# EAGLE design WeatherStation-MM-Carrier (EAGLE 9.4.2)
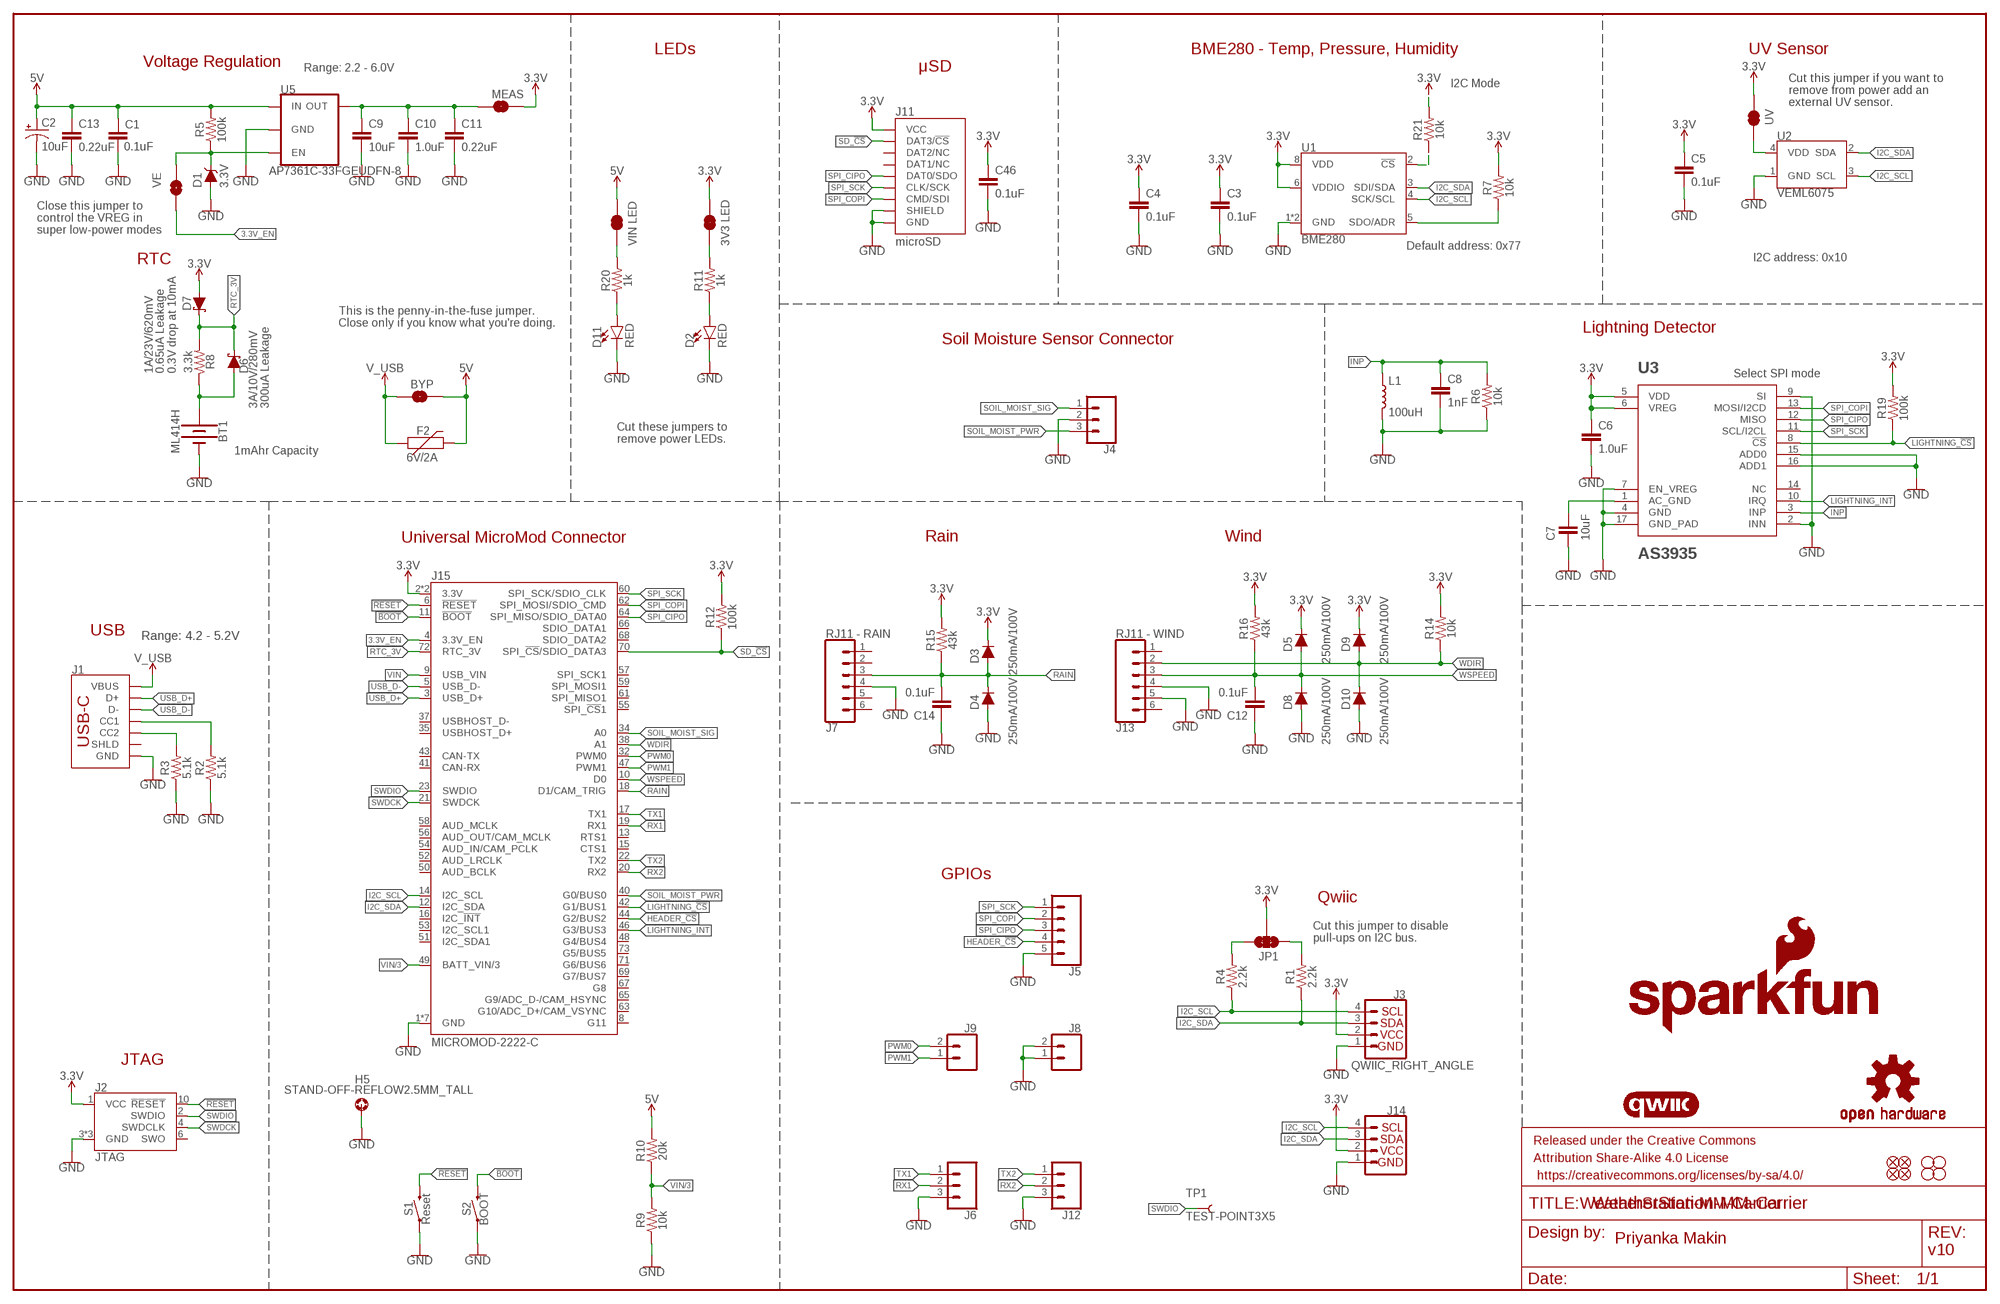
[diagram p0: schematic, sheet 1]

## Parts
BT1  ML414H  ML414H_IV01E_BATTERY  [ML414H_IV01E]
BYP  JUMPER-SMT_2_NO_SILK  [SMT-JUMPER_2_NO_SILK]
C1  0.1uF  0.1UF-0603-25V-(+80/-20%)  [0603]
C2  10uF  10UF-POLAR-EIA3216-16V-10%(TANT)  [EIA3216]
C3  0.1uF  0.1UF-0603-100V-10%  [0603]
C4  0.1uF  0.1UF-0603-100V-10%  [0603]
C5  0.1uF  0.1UF-0603-25V-(+80/-20%)  [0603]
C6  1.0uF  1.0UF-0603-16V-10%  [0603]
C7  10uF  10UF-0603-6.3V-20%  [0603]
C8  1nF  1.0NF/1000PF-0603-50V-10%  [0603]
C9  10uF  10UF-0603-6.3V-20%  [0603]
C10  1.0uF  1.0UF-0603-16V-10%  [0603]
C11  0.22uF  0.22UF-0603-25V-10%  [0603]
C12  0.1uF  0.1UF-0603-25V-(+80/-20%)  [0603]
C13  0.22uF  0.22UF-0603-25V-10%  [0603]
C14  0.1uF  0.1UF-0603-25V-(+80/-20%)  [0603]
C46  0.1uF  0.1UF-0603-25V-(+80/-20%)  [0603]
D1  3.3V  DIODE-ZENER-MM3Z3V3T1G  [SOD-323]
D2  RED  LED-RED0603  [LED-0603]
D3  250mA/100V  DIODE-BAS16J  [SOD-323]
D4  250mA/100V  DIODE-BAS16J  [SOD-323]
D5  250mA/100V  DIODE-BAS16J  [SOD-323]
D6  3A/10V/280mV  DIODE-SCHOTTKY-BAT60A  [SOD-323]
D7  1A/23V/620mV  DIODE-SCHOTTKY-BAT20J  [SOD-323]
D8  250mA/100V  DIODE-BAS16J  [SOD-323]
D9  250mA/100V  DIODE-BAS16J  [SOD-323]
D10  250mA/100V  DIODE-BAS16J  [SOD-323]
D11  RED  LED-RED0603  [LED-0603]
F2  6V/2A  PPTC_6V2A  [1210]
FD1  FIDUCIALUFIDUCIAL  [FIDUCIAL-MICRO]
FD2  FIDUCIALUFIDUCIAL  [FIDUCIAL-MICRO]
FD3  FIDUCIALUFIDUCIAL  [FIDUCIAL-MICRO]
FD4  FIDUCIALUFIDUCIAL  [FIDUCIAL-MICRO]
FRAME1  FRAME-LEDGER  [CREATIVE_COMMONS]
H1  STAND-OFF  [STAND-OFF]
H2  STAND-OFF  [STAND-OFF]
H3  STAND-OFF  [STAND-OFF]
H4  STAND-OFF  [STAND-OFF]
H5  STAND-OFF-REFLOW2.5MM_TALL  [STAND-OFF-REFLOW-M2.5]
J1  USB_C_2-LAYER_PADS  [USB-C-16P-2LAYER-PADS]
J2  JTAG  CORTEX_JTAG_DEBUG_MINIMUM_PTH  [2X5-PTH-1.27MM]
J3  QWIIC_RIGHT_ANGLE  QWIIC_CONNECTORJS-1MM  [JST04_1MM_RA]
J4  CONN_03LATCH  [LATCHTERMINAL-5MM-3]
J5  CONN_05NO_SILK  [1X05_NO_SILK]
J6  CONN_031X03_NO_SILK  [1X03_NO_SILK]
J7  RJ11 - RAIN  RJ11-6  [RJ11-6]
J8  CONN_021X02_NO_SILK  [1X02_NO_SILK]
J9  CONN_021X02_NO_SILK  [1X02_NO_SILK]
J11  microSD  MICRO-SD-SDIOPUSH-PUSH  [MICRO-SD-SOCKET]
J12  CONN_031X03_NO_SILK  [1X03_NO_SILK]
J13  RJ11 - WIND  RJ11-6  [RJ11-6]
J14  I2C_STANDARD_NO_SILK  [1X04_NO_SILK]
J15  MICROMOD-2222-C  [M.2-CONNECTOR-E]
JP1  JUMPER-SMT_3_2-NC_TRACE_SILK  [SMT-JUMPER_3_2-NC_TRACE_SILK]
JP2  VIN LED  JUMPER-SMT_2_NC_TRACE_SILK  [SMT-JUMPER_2_NC_TRACE_SILK]
JP3  UV  JUMPER-SMT_2_NC_TRACE_SILK  [SMT-JUMPER_2_NC_TRACE_SILK]
JP4  3V3 LED  JUMPER-SMT_2_NC_TRACE_SILK  [SMT-JUMPER_2_NC_TRACE_SILK]
JP6  VE  JUMPER-SMT_2_NO_SILK  [SMT-JUMPER_2_NO_SILK]
L1  100uH  MA5532-AE  [MA5532-AE]
LOGO1  SFE_LOGO_NAME_FLAME.2_INCH  [SFE_LOGO_NAME_FLAME_.2]
LOGO2  QWIIC_LOGO_CONNECTOR  [QWIIC_5.5MM]
LOGO3  OSHW-LOGOM  [OSHW-LOGO-M]
MEAS  JUMPER-COMBO_2_NC_TRACE  [COMBO-JUMPER_2_NC_TRACE]
R1  2.2k  2.2KOHM-0603-1/10W-1%  [0603]
R2  5.1k  5.1KOHM5.1KOHM-0603-1/10W-1%  [0603]
R3  5.1k  5.1KOHM5.1KOHM-0603-1/10W-1%  [0603]
R4  2.2k  2.2KOHM-0603-1/10W-1%  [0603]
R5  100k  100KOHM-0603-1/10W-1%  [0603]
R6  10k  10KOHM-0603-1/10W-1%  [0603]
R7  10k  10KOHM-0603-1/10W-1%  [0603]
R8  3.3k  3.3KOHM-0603-1/10W-1%  [0603]
R9  10k  10KOHM-0603-1/10W-1%  [0603]
R10  20k  20KOHM-0603-1/10W-1%  [0603]
R11  1k  1KOHM-0603-1/10W-1%  [0603]
R12  100k  100KOHM-0603-1/10W-1%  [0603]
R14  10k  10KOHM-0603-1/10W-1%  [0603]
R15  43k  43KOHM-0603-1/10W-1%  [0603]
R16  43k  43KOHM-0603-1/10W-1%  [0603]
R19  100k  100KOHM-0603-1/10W-1%  [0603]
R20  1k  1KOHM-0603-1/10W-1%  [0603]
R21  10k  10KOHM-0603-1/10W-1%  [0603]
S1  Reset  MOMENTARY-SWITCH-SPST-SMD-5.2-TALL-REDUNDANT  [TACTILE_SWITCH_SMD_5.2MM]
S2  BOOT  MOMENTARY-SWITCH-SPST-SMD-5.2-TALL-REDUNDANT  [TACTILE_SWITCH_SMD_5.2MM]
TP1  TEST-POINT3X5  [PAD.03X.05]
U1  BME280  [LGA-8-2.5X2.5]
U2  VEML6075  [VEML6075_A3OP]
U3  AS3935  AS3935QFN  [16LD_MLPQ]
U5  AP7361C-33FGEUDFN-8  [UDFN-8]

## Nets
3.3V: C3.1 C4.1 C5.1 C6.1 C46.1 D3.C D5.C D7.A D9.C J2.1(VCC) J3.2 J11.VCC J14.2 J15.2(3.3V) J15.74(3.3V) JP1.2 JP3.2 JP4.2 MEAS.2 MEAS.4 R7.2 R12.2 R14.2 R15.2 R16.2 R19.2 R21.2 U1.6(VDDIO) U1.8(VDD) U3.5(VDD) U3.6(VREG)
3.3V_EN: J15.4(3.3V_EN) JP6.1
!BOOT!: J15.11(!BOOT!) S2.3 S2.4
!RESET!: J2.10(!RESET) J15.6(!RESET!) S1.3 S1.4
GND: BT1.- C1.2 C2.- C3.2 C4.2 C5.2 C6.2 C7.2 C8.2 C9.2 C10.2 C11.2 C12.1 C13.2 C14.1 C46.2 D1.A D2.C D4.A D8.A D10.A D11.C H5.1 J1.GND J1.GND2(GND) J2.3(GND) J2.5(GND) J2.9(GND) J3.1 J4.2 J5.5 J6.3 J7.4 J8.1 J8.2 J11.CD1(SHIELD) J11.GND J11.GND1(GND) J11.GND3(GND) J12.3 J13.4 J13.5 J14.1 J15.1(GND) J15.7(GND) J15.33(GND) J15.36(GND) J15.39(GND) J15.45(GND) J15.75(GND) L1.2 R2.1 R3.1 R6.1 R9.1 S1.1 S1.2 S2.1 S2.2 U1.1(GND) U1.7(GND) U2.1(GND) U3.2(INN) U3.4(GND) U3.7(EN_VREG) U3.9(SI) U3.15(ADD0) U3.16(ADD1) U3.17(GND_PAD) U5.4(GND) U5.EP(GND)
HEADER_!CS!: J5.4 J15.44(G2/BUS2)
I2C_SCL: J3.4 J14.4 J15.14(I2C_SCL) R4.1 U1.4(SCK/SCL) U2.3(SCL)
I2C_SDA: J3.3 J14.3 J15.12(I2C_SDA) R1.1 U1.3(SDI/SDA) U2.2(SDA)
INP: C8.1 L1.1 R6.2 U3.3(INP)
LIGHTNING_!CS!: J15.42(G1/BUS1) R19.1 U3.8(!CS)
LIGHTNING_INT: J15.46(G3/BUS3) U3.10(IRQ)
N$1: C9.1 C10.1 C11.1 MEAS.1 MEAS.3 U5.1(OUT)
N$2: JP1.3 R4.2
N$3: JP1.1 R1.2
N$4: JP4.1 R11.2
N$5: JP2.1 R20.2
N$6: D2.A R11.1
N$7: JP3.1 U2.4(VDD)
N$8: R7.1 U1.5(SDO/ADR)
N$10: J1.A5(CC1) R2.2
N$11: J1.B5(CC2) R3.2
N$14: BT1.+ D6.A R8.1
N$15: C7.1 U3.1(AC_GND)
N$16: D11.A R20.1
N$19: R21.1 U1.2(!CS)
PWM0: J9.2 J15.32(PWM0)
PWM1: J9.1 J15.47(PWM1)
RAIN: C14.2 D3.A D4.C J7.3 J15.18(D1/CAM_TRIG) R15.1
RTC_3V: D6.C D7.C J15.72(RTC_3V) R8.2
RX1: J6.2 J15.19(RX1)
RX2: J12.2 J15.20(RX2)
SD_!CS!: J11.CS/DAT3(DAT3/!CS!) J15.70(SPI_!CS!/SDIO_DATA3) R12.1
SOIL_MOIST_PWR: J4.3 J15.40(G0/BUS0)
SOIL_MOIST_SIG: J4.1 J15.34(A0)
SPI_CIPO: J5.3 J11.DO/DAT0(DAT0/SDO) J15.64(SPI_MISO/SDIO_DATA0) U3.12(MISO)
SPI_COPI: J5.2 J11.DI/CMD(CMD/SDI) J15.62(SPI_MOSI/SDIO_CMD) U3.13(MOSI/I2CD)
SPI_SCK: J5.1 J11.SCLK(CLK/SCK) J15.60(SPI_SCK/SDIO_CLK) U3.11(SCL/I2CL)
SWDCK: J2.4(SWDCLK) J15.21(SWDCK)
SWDIO: J2.2(SWDIO) J15.23(SWDIO) TP1.P$1
TX1: J6.1 J15.17(TX1)
TX2: J12.1 J15.22(TX2)
USB_D+: J1.A6(D+) J1.B6(D+) J15.3(USB_D+)
USB_D-: J1.A7(D-) J1.B7(D-) J15.5(USB_D-)
V_USB: BYP.1 F2.1 J1.VBUS1(VBUS) J1.VBUS2(VBUS)
VIN: BYP.2 C1.1 C2.+ C13.1 F2.2 J15.9(USB_VIN) JP2.2 R5.2 R10.2 U5.8(IN) ; supply symbol labelled 5V
VIN/3: J15.49(BATT_VIN/3) R9.2 R10.1
VREG_EN: D1.C JP6.2 R5.1 U5.5(EN)
WDIR: D9.A D10.C J13.2 J15.38(A1) R14.1
WSPEED: C12.2 D5.A D8.C J13.3 J15.10(D0) R16.1
Unconnected: J1.SHLD1(SHLD) J1.SHLD2(SHLD) J1.SHLD3(SHLD) J1.SHLD4(SHLD) J2.6(SWO) J7.1 J7.2 J7.5 J7.6 J11.DAT1(DAT1/NC) J11.DAT2(DAT2/NC) J13.1 J13.6 J15.8(G11) J15.13(RTS1) J15.15(CTS1) J15.16(I2C_!INT!) J15.35(USBHOST_D+) J15.37(USBHOST_D-) J15.41(CAN-RX) J15.43(CAN-TX) J15.48(G4/BUS4) J15.50(AUD_BCLK) J15.51(I2C_SDA1) J15.52(AUD_LRCLK) J15.53(I2C_SCL1) J15.54(AUD_IN/CAM_PCLK) J15.55(SPI_!CS!1) J15.56(AUD_OUT/CAM_MCLK) J15.57(SPI_SCK1) J15.58(AUD_MCLK) J15.59(SPI_MOSI1) J15.61(SPI_MISO1) J15.63(G10/ADC_D+/CAM_VSYNC) J15.65(G9/ADC_D-/CAM_HSYNC) J15.66(SDIO_DATA1) J15.67(G8) J15.68(SDIO_DATA2) J15.69(G7/BUS7) J15.71(G6/BUS6) J15.73(G5/BUS5) U3.14(NC)

## Notes on the sheet
- LEDs | BME280 - Temp, Pressure, Humidity | UV Sensor
- Voltage Regulation
- Range: 2.2 - 6.0V | μSD
- I2C Mode
- Cut this jumper if you want to
  remove from power add an 
  external UV sensor.
- Close this jumper to 
  control the VREG in 
  super low-power modes
- Default address: 0x77
- RTC | I2C address: 0x10
- This is the penny-in-the-fuse jumper.
  Close only if you know what you're doing.
- Lightning Detector
- Soil Moisture Sensor Connector
- 0.65uA Leakage
  0.3V drop at 10mA
- Select SPI mode
- 300uA Leakage
- Cut these jumpers to
  remove power LEDs.
- 1mAhr Capacity
- Universal MicroMod Connector | Rain | Wind
- USB
- Range: 4.2 - 5.2V
- GPIOs
- Qwiic
- Cut this jumper to disable
  pull-ups on I2C bus.
- JTAG
- WeatherStation-MM-Carrier
- Priyanka Makin
- v10

## Library data of the parts
BT1 = SparkFun-Batteries:ML414H_IV01E_BATTERY: SEIKO ML414H-IV01E Reflowable Lithium Battery ML414H is a rechargeable, coin type battery with features such as Pb-free reflowable (Peak temperature: 260 C) and high temperature heat resistance. Battery Characteristics: 3.1V max voltage Voff is 2V 1mAH 3k series resistor with battery 72 hour charge time from 2.0-3.1V 2.3-2.8V initial charge; PROD_ID: BATT-14267
BYP JP6 = SparkFun-Jumpers:JUMPER-SMT_2_NO: Normally open jumper This jumper has two pads in close proximity to each other. Apply solder to close the connection. Round pads are easier to solder for beginners, but are a lot larger. SparkFun Product that uses the round pads: SparkFun EL Sequencer <https://www.sparkfun.com/products/12781>
C1 C5 C12 C14 C46 = SparkFun-Capacitors:0.1UF: 0.1µF ceramic capacitors A capacitor is a passive two-terminal electrical component used to store electrical energy temporarily in an electric field.; PROD_ID: CAP-00810
C2 = SparkFun-Capacitors:10UF-POLAR: 10.0µF polarized capacitors A capacitor is a passive two-terminal electrical component used to store electrical energy temporarily in an electric field.; PROD_ID: CAP-00811
C3 C4 = SparkFun-Capacitors:0.1UF: 0.1µF ceramic capacitors A capacitor is a passive two-terminal electrical component used to store electrical energy temporarily in an electric field.; PROD_ID: CAP-08390
C6 C10 = SparkFun-Capacitors:1.0UF: 1µF ceramic capacitors A capacitor is a passive two-terminal electrical component used to store electrical energy temporarily in an electric field.; PROD_ID: CAP-00868
C7 C9 = SparkFun-Capacitors:10UF: 10.0µF ceramic capacitors A capacitor is a passive two-terminal electrical component used to store electrical energy temporarily in an electric field.; PROD_ID: CAP-11015
C8 = SparkFun-Capacitors:1.0NF/1000PF: 1nF/1,000pF ceramic capacitors A capacitor is a passive two-terminal electrical component used to store electrical energy temporarily in an electric field.; PROD_ID: CAP-07886
C11 C13 = SparkFun-Capacitors:0.22UF: 0.22µF ceramic capacitors A capacitor is a passive two-terminal electrical component used to store electrical energy temporarily in an electric field.; PROD_ID: CAP-07822
D1 = SparkFun-DiscreteSemi:DIODE-ZENER: Zener Diode A Zener diode allows current to flow from its anode to its cathode like a normal semiconductor diode, but it also permits current to flow in the reverse direction when its "Zener voltage" is reached. - WIkipedia; PROD_ID: DIO-11284
D2 D11 = SparkFun-LED:LED-RED: Red SMD LED Used in manufacturing of most products at SparkFun Packages: 0603 - SMD 0603 package [Product Link] <http://docs.avagotech.com/docs/AV02-0551EN> 0603 SMART - SMD 0603 SMART package ( more efficient and expensive)[Product Link] <http://www.osram-os.com/Graphics/XPic2/00077099_0.pdf> 1206 - SMD1206 package [Product Link] <https://www.sparkfun.com/datasheets/DevTools/LilyPad/Q150OVS4.pdff> SparkFun Products: Pro Mini 328 -5V <https://www.sparkfun.com/products/821> RedBoard <https://www.sparkfun.com/products/12757> IOIO-OTG <https://www.sparkfun.com/products/13613>; PROD_ID: DIO-00819
D3-D5 D8-D10 = SparkFun-DiscreteSemi:DIODE: Diode These are standard reverse protection diodes and small signal diodes. SparkFun Products: SparkFun SparkPunk Sound Kit <https://www.sparkfun.com/products/11177> SparkFun ESP8266 Thing <https://www.sparkfun.com/products/13231>; PROD_ID: DIO-09646
D6 = SparkFun-DiscreteSemi:DIODE-SCHOTTKY: Schottky diode A Schottky diode is a semiconductor diode which has a low forward voltage drop and a very fast switching action.; PROD_ID: DIO-14072
D7 = SparkFun-DiscreteSemi:DIODE-SCHOTTKY: Schottky diode A Schottky diode is a semiconductor diode which has a low forward voltage drop and a very fast switching action.; PROD_ID: DIO-11623
F2 = SparkFun-Fuses:PPTC: Resettable Fuse PPTC Resettable Fuse. Really a sort of resistor with a polymeric positive temperature coefficient whose resistance increases dramatically with an increase in temperature. When heated by the power passing through the resistance rises causing the current to be limited, protecting the circuit. This is achieved by the transition of the polymer from a crystalline to an amorphous state where the conductive carbon separates breaking the conductive pathways found in the cool crystalline structure. When a PPTC cools back down it resumes conducting letting the circuit turn back on. SparkFun Products: SparkFun RedBoard - Programmed with Arduino <https://www.sparkfun.com/products/12757> Pro Micro - 5V/16MHz <https://www.sparkfun.com/products/12640> Arduino Pro 328 - 5V/16MHz <https://www.sparkfun.com/products/10915> MP3 Trigger <https://www.sparkfun.com/products/13720>; PROD_ID: RES-14313
FD1-FD4 = SparkFun-Aesthetics:FIDUCIAL: Fiducial Alignment Points Point-of-reference for pick-and-place machines and other optical instruments.
FRAME1 = SparkFun-Aesthetics:FRAME-LEDGER: Schematic Frame - Ledger Standard 11x14 US Ledger frame
H1-H4 = SparkFun-Hardware:STAND-OFF: Stand Off Drill holes for mechanically mounting via screws, standoffs, etc. Note: Use the keepout ring to avoid running the screw head into surrounding components. Variant Overviews STAND-OFF - Mechanical footprint for a #4 phillips button head screw. STAND-OFF-TIGHT - Mechanical footprint for a #4 phillips button head screw, Example SparkFun Products Screw - Phillips Head (1/4", 4-40, 10 pack) <https://www.sparkfun.com/products/10453> (PRT-10453) Screw - Phillips Head (1/2", 4-40, 10 pack) <https://www.sparkfun.com/products/10452> (PRT-10452) Screw - Phillips Head (3/4", 4-40, 10 pack) <https://www.sparkfun.com/products/10451> (PRT-10451) Screw - Phillips Head (1", 4-40, 10 pack) <https://www.sparkfun.com/products/10450> (PRT-10450)
H5 = SparkFun-Hardware:STAND-OFF-REFLOW: Stand Off Reflow Compatible A metal standoff that can be placed and reflowed onto a PCB.; PROD_ID: HW-14899
J1 = SparkFun-Connectors:USB_C: USB Type C 16Pin Connector Super Speed pins not available on the 16-pin purely SMD connector so this part is best for USB 2.0 implementations. D1 and D2 are tied together enabling D+/- no matter which way the cable is plugged into the connector. The two channel configuration pins (CC1/2) are exposed. These are normally connected to ground via 5.1k resistors but can be reconfigured for high current/high power applications.; PROD_ID: CONN-14122
J2 = SparkFun-Connectors:CORTEX_JTAG_DEBUG_MINIMUM: Cortex Debug Connector - 10 pin Supports JTAG debug, Serial Wire debug, and Serial Wire Viewer. PTH and SMD connector options available. General Connector Information <http://infocenter.arm.com/help/topic/com.arm.doc.faqs/attached/13634/cortex_debug_connectors.pdf> Products: PTH Connector <http://www.digikey.com/product-detail/en/cnc-tech/3220-10-0100-00/1175-1627-ND/3883661> -via Digi-Key SparkFun PSoc <https://www.sparkfun.com/products/13229> SparkFun T <https://www.sparkfun.com/products/13810>
J3 = SparkFun-Connectors:QWIIC_CONNECTOR: SparkFun I2C Standard Qwiic Connector An SMD 1mm pitch JST connector makes it easy and quick (get it? Qwiic?) to connect I2C devices to each other. The Qwiic system <http://www.sparkfun.com/qwiic> enables fast and solderless connection between popular platforms and various sensors and actuators. We carry 200mm <https://www.sparkfun.com/products/14204>, 100mm <https://www.sparkfun.com/products/14205>, 50mm <https://www.sparkfun.com/products/14206>, and breadboard friendly <https://www.sparkfun.com/products/14207> Qwiic cables. We also offer 10 pcs strips <https://www.sparkfun.com/products/14323> the SMD connectors.; PROD_ID: CONN-13694
J4 = SparkFun-Connectors:CONN_03: Multi connection point. Often used as Generic Header-pin footprint for 0.1 inch spaced/style header connections On any of the 0.1 inch spaced packages, you can populate with these: Break Away Headers - Straight <https://www.sparkfun.com/products/116> (PRT-00116) Break Away Male Headers - Right Angle <https://www.sparkfun.com/products/553> (PRT-00553) Female Headers <https://www.sparkfun.com/products/115> (PRT-00115) Break Away Headers - Machine Pin <https://www.sparkfun.com/products/117> (PRT-00117) Break Away Female Headers - Swiss Machine Pin <https://www.sparkfun.com/products/743> (PRT-00743) Stackable Header - 3 Pin (Female, 0.1") <https://www.sparkfun.com/products/13875> (PRT-13875) For SCREWTERMINALS and SPRING TERMINALS visit here: Screw Terimnals on SparkFun.com <https://www.sparkfun.com/search/results?term=Screw+Terminals> (5mm/3.5mm/2.54mm spacing) This device is also useful as a general connection point to wire up your design to another part of your project. Our various solder wires solder well into these plated through hole pads. Hook-Up Wire - Assortment (Stranded, 22 AWG) <https://www.sparkfun.com/products/11375> (PRT-11375) Hook-Up Wire - Assortment (Solid Core, 22 AWG) <https://www.sparkfun.com/products/11367> (PRT-11367) View the entire wire category on our website here <https://www.sparkfun.com/categories/141> Special notes: Molex polarized connector foot print use with SKU : PRT-08232 with associated crimp pins and housings.; PROD_ID: CONN-14721
J5 = SparkFun-Connectors:CONN_05: Multi connection point. Often used as Generic Header-pin footprint for 0.1 inch spaced/style header connections On any of the 0.1 inch spaced packages, you can populate with these: Break Away Headers - Straight <https://www.sparkfun.com/products/116> (PRT-00116) Break Away Male Headers - Right Angle <https://www.sparkfun.com/products/553> (PRT-00553) Female Headers <https://www.sparkfun.com/products/115> (PRT-00115) Break Away Headers - Machine Pin <https://www.sparkfun.com/products/117> (PRT-00117) Break Away Female Headers - Swiss Machine Pin <https://www.sparkfun.com/products/743> (PRT-00743) For SCREWTERMINALS and SPRING TERMINALS visit here: Screw Terimnals on SparkFun.com <https://www.sparkfun.com/search/results?term=Screw+Terminals> (5mm/3.5mm/2.54mm spacing) This device is also useful as a general connection point to wire up your design to another part of your project. Our various solder wires solder well into these plated through hole pads. Hook-Up Wire - Assortment (Stranded, 22 AWG) <https://www.sparkfun.com/products/11375> (PRT-11375) Hook-Up Wire - Assortment (Solid Core, 22 AWG) <https://www.sparkfun.com/products/11367> (PRT-11367) View the entire wire category on our website here <https://www.sparkfun.com/categories/141> Special notes: Molex polarized connector foot print use with SKU : PRT-08231 with associated crimp pins and housings. 1MM SMD Version SKU: PRT-10208
J6 J12 = SparkFun-Connectors:CONN_03: Multi connection point. Often used as Generic Header-pin footprint for 0.1 inch spaced/style header connections On any of the 0.1 inch spaced packages, you can populate with these: Break Away Headers - Straight <https://www.sparkfun.com/products/116> (PRT-00116) Break Away Male Headers - Right Angle <https://www.sparkfun.com/products/553> (PRT-00553) Female Headers <https://www.sparkfun.com/products/115> (PRT-00115) Break Away Headers - Machine Pin <https://www.sparkfun.com/products/117> (PRT-00117) Break Away Female Headers - Swiss Machine Pin <https://www.sparkfun.com/products/743> (PRT-00743) Stackable Header - 3 Pin (Female, 0.1") <https://www.sparkfun.com/products/13875> (PRT-13875) For SCREWTERMINALS and SPRING TERMINALS visit here: Screw Terimnals on SparkFun.com <https://www.sparkfun.com/search/results?term=Screw+Terminals> (5mm/3.5mm/2.54mm spacing) This device is also useful as a general connection point to wire up your design to another part of your project. Our various solder wires solder well into these plated through hole pads. Hook-Up Wire - Assortment (Stranded, 22 AWG) <https://www.sparkfun.com/products/11375> (PRT-11375) Hook-Up Wire - Assortment (Solid Core, 22 AWG) <https://www.sparkfun.com/products/11367> (PRT-11367) View the entire wire category on our website here <https://www.sparkfun.com/categories/141> Special notes: Molex polarized connector foot print use with SKU : PRT-08232 with associated crimp pins and housings.
J7 J13 = SparkFun-Connectors:RJ11-6: RJ11 Jack - 6 pin Commonly found on CAT3 devices and some Microchip programmers. Here is the connector we sell at SparkFun: RJ11 6-Pin Connector <https://www.sparkfun.com/products/132> (PRT-00132) Datasheet <http://www.sparkfun.com/datasheets/Prototyping/Connectors/RJ11-Datasheet.pdf> It is used on this SparkFun product: SparkFun Weather Shield <https://www.sparkfun.com/products/12081> (DEV-12081) Weather Meters <https://www.sparkfun.com/products/8942> (SEN-08942); PROD_ID: CONN-08590; SF_ID: PRT-00132; VALUE: RJ11
J8 J9 = SparkFun-Connectors:CONN_02: Multi connection point. Often used as Generic Header-pin footprint for 0.1 inch spaced/style header connections On any of the 0.1 inch spaced packages, you can populate with these: Break Away Headers - Straight <https://www.sparkfun.com/products/116> (PRT-00116) Break Away Male Headers - Right Angle <https://www.sparkfun.com/products/553> (PRT-00553) Female Headers <https://www.sparkfun.com/products/115> (PRT-00115) Break Away Headers - Machine Pin <https://www.sparkfun.com/products/117> (PRT-00117) Break Away Female Headers - Swiss Machine Pin <https://www.sparkfun.com/products/743> (PRT-00743) For SCREWTERMINALS and SPRING TERMINALS visit here: Screw Terimnals on SparkFun.com <https://www.sparkfun.com/search/results?term=Screw+Terminals> (5mm/3.5mm/2.54mm spacing) This device is also useful as a general connection point to wire up your design to another part of your project. Our various solder wires solder well into these plated through hole pads. Hook-Up Wire - Assortment (Stranded, 22 AWG) <https://www.sparkfun.com/products/11375> (PRT-11375) Hook-Up Wire - Assortment (Solid Core, 22 AWG) <https://www.sparkfun.com/products/11367> (PRT-11367) View the entire wire category on our website here <https://www.sparkfun.com/categories/141> Special notes: Molex polarized connector foot print use with: PRT-08233 with associated crimp pins and housings. 2.54_SCREWTERM for use with PRT-10571. 3.5mm Screw Terminal footprints for PRT-08084 5mm Screw Terminal footprints for use with PRT-08432
J11 = SparkFun-Connectors:MICRO-SD-SDIO: microSD Socket for Transflash Push-push type µSD socket. tDoc lines correctly indicate media card edge positions when inserting (unlocked, locked, depressed). NOTE: CD1 and CD2 are connected internally, and the default detect state of the socket is detect pin to ground. SparkFun Products: WAV Trigger <https://www.sparkfun.com/products/13660> CAN-Bus Shield <https://www.sparkfun.com/products/13262> SparkFun Level Shifing microSD Breakout <https://www.sparkfun.com/products/13743>; PROD_ID: CONN-07820
J14 = SparkFun-Connectors:I2C_STANDARD: SparkFun I2C Standard Pinout Header SparkFun has standardized on a pinout for all I2C based sensor breakouts. This pinout allows I2C boards to be plugged directly into the headers on Arduino Uno compatible boards, and to be daisy chained easily. Example SparkFun Products: SparkFun Atmospheric Sensor Breakout - BME280 <https://www.sparkfun.com/products/13676> SparkFun Altitude/Pressure Sensor Breakout - MPL3115A2 <https://www.sparkfun.com/products/11084> SparkFun TOF Range Finder Sensor - VL6180 <https://www.sparkfun.com/products/12785>
J15 = SparkFun-MicroMod:MICROMOD: MicroMod Connector Description: A card edge connector and mating PCB connector to allow various MicroMod Processor Boards to be coupled with various carrier boards of different capabilities. Based on the M.2 standard.; PROD_ID: CONN-14877
JP1 = SparkFun-Jumpers:JUMPER-SMT_3_2-NC_TRACE: Normally closed trace jumper (2 of 2 connections) This jumper has a trace between all three pads so they are normally closed (NC). Use a razor knife to open the connection(s). For best results follow the IPC guidelines for cutting traces: Cutout at least 0.063 mm (0.005 in). Remove all loose material to clean up the cut area. Seal the cut with an approved epoxy. Reapply solder to reclose the connection(s).
JP2-JP4 = SparkFun-Jumpers:JUMPER-SMT_2_NC_TRACE: Normally closed trace jumper This jumper has a trace between two pads so it's normally closed (NC). Use a razor knife to open the connection. For best results follow the IPC guidelines for cutting traces: Cutout at least 0.063 mm (0.005 in). Remove all loose material to clean up the cut area. Seal the cut with an approved epoxy. Reapply solder to reclose the connection.
L1 = SparkFun-Coils:MA5532-AE: RFID Transponder Coil - MA5532-AE; PROD_ID: NDUC-11334
LOGO1 = SparkFun-Aesthetics:SFE_LOGO_NAME_FLAME: SparkFun Font Logo w/ Flame This is the SparkFun full logo. The logo on the schematic will always be the same size; the package variant is the height of the flame part of the logo. Default layer for the logo on the board is tSilk.
LOGO2 = SparkFun-Aesthetics:QWIIC_LOGO: Qwiic Logos for placement on schematic and PCB. The 5.5mm silk logo is best for placing next to Qwiic connector.
LOGO3 = SparkFun-Aesthetics:OSHW-LOGO: Open-Source Hardware (OSHW) Logo This logo indicates the piece of hardware it is found on incorporates a OSHW license and/or adheres to the definition of open source hardware found here: http://freedomdefined.org/OSHW
MEAS = SparkFun-Jumpers:JUMPER-COMBO_2_NC_TRACE
R1 R4 = SparkFun-Resistors:2.2KOHM: 2.2kΩ resistor A resistor is a passive two-terminal electrical component that implements electrical resistance as a circuit element. Resistors act to reduce current flow, and, at the same time, act to lower voltage levels within circuits. - Wikipedia; PROD_ID: RES-08272
R2 R3 = SparkFun-Resistors:5.1KOHM; PROD_ID: RES-12083
R5 R12 R19 = SparkFun-Resistors:100KOHM: 100kΩ resistor A resistor is a passive two-terminal electrical component that implements electrical resistance as a circuit element. Resistors act to reduce current flow, and, at the same time, act to lower voltage levels within circuits. - Wikipedia; PROD_ID: RES-07828
R6 R7 R9 R14 R21 = SparkFun-Resistors:10KOHM: 10kΩ resistor A resistor is a passive two-terminal electrical component that implements electrical resistance as a circuit element. Resistors act to reduce current flow, and, at the same time, act to lower voltage levels within circuits. - Wikipedia; PROD_ID: RES-00824
R8 = SparkFun-Resistors:3.3KOHM: 3.3kΩ resistor A resistor is a passive two-terminal electrical component that implements electrical resistance as a circuit element. Resistors act to reduce current flow, and, at the same time, act to lower voltage levels within circuits. - Wikipedia; PROD_ID: RES-07851
R10 = SparkFun-Resistors:20KOHM: 20kΩ resistor A resistor is a passive two-terminal electrical component that implements electrical resistance as a circuit element. Resistors act to reduce current flow, and, at the same time, act to lower voltage levels within circuits. - Wikipedia; PROD_ID: RES-09383
R11 R20 = SparkFun-Resistors:1KOHM: 1kΩ resistor A resistor is a passive two-terminal electrical component that implements electrical resistance as a circuit element. Resistors act to reduce current flow, and, at the same time, act to lower voltage levels within circuits. - Wikipedia; PROD_ID: RES-07856
R15 R16 = SparkFun-Resistors:43KOHM: 43kΩ resistor A resistor is a passive two-terminal electrical component that implements electrical resistance as a circuit element. Resistors act to reduce current flow, and, at the same time, act to lower voltage levels within circuits. - Wikipedia; PROD_ID: RES-07858
S1 S2 = SparkFun-Switches:MOMENTARY-SWITCH-SPST: Momentary Switch (Pushbutton) - SPST Normally-open (NO) SPST momentary switches (buttons, pushbuttons). Variants PTH-12MM - 12mm square, through-hole Momentary Pushbutton Switch - 12mm Square <https://www.sparkfun.com/products/9190> (COM-09190) PTH-6.0MM, PTH-6.0MM-KIT - 6.0mm square, through-hole Mini Pushbutton Switch <https://www.sparkfun.com/products/97> (COM-00097) KIT package intended for soldering kit's - only one side of pads' copper is exposed. PTH-RIGHT-ANGLE-KIT - Right-angle, through-hole Right Angle Tactile Button <https://www.sparkfun.com/products/10791> - Used on SparkFun BigTime Watch Kit <https://www.sparkfun.com/products/11734> SMD-12MM - 12mm square, surface-mount Tactile Button - SMD (12mm) <https://www.sparkfun.com/products/12993> (COM-12993) Used on SparkFun PicoBoard <https://www.sparkfun.com/products/11888> SMD-4.5MM - 4.5mm Square Trackball Switch Used on SparkFun Blackberry Trackballer Breakout <https://www.sparkfun.com/products/13169> SMD-4.6MMX2.8MM - 4.60mm x 2.80mm, surface mount Used on SparkFun SAMD21 Mini Breakout <https://www.sparkfun.com/products/13664> SMD-5.2MM, SMD-5.2-REDUNDANT - 5.2mm square, surface-mount Mini Pushbutton Switch - SMD <https://www.sparkfun.com/products/8720> (COM-08720) Used on Arduino Pro Mini <https://www.sparkfun.com/products/11114> REDUNDANT package connects both switch circuits together SMD-6.0X3.5MM - 6.0 x 3.5mm, surface mount Momentary Reset Switch SMD <https://www.sparkfun.com/products/8229> (COM-08229) SMD-6.2MM-TALL - 6.2mm square, surface mount Tactile Button - SMD (6mm) <https://www.sparkfun.com/products/12992> Used on SparkFun Digital Sandbox <https://www.sparkfun.com/products/12651> SMD-RIGHT-ANGLE - Right-angle, surface mount Used on SparkFun Block for Intel® Edison - Arduino <https://www.sparkfun.com/products/13036>; PROD_ID: SWCH-14139
TP1 = SparkFun-Connectors:TEST-POINT: SparkFun Test Points Bare copper test points for troubleshooting or In-Circuit-Testing. These are used by our Production team for verifying production board runs using pogo-pins on test beds. SparkFun Products: SparkFun LSM9DS1 Breakout <https://www.sparkfun.com/products/13284> SparkFun PSOC <https://www.sparkfun.com/products/13714> SparkFun Load Cell Amplifier <https://www.sparkfun.com/products/13879>
U1 = SparkFun-Sensors:BME280: Bosch BME280 – Combined Humidity and Pressure Sensor The BME280 is as combined digital humidity, pressure and temperature sensor based on proven sensing principles. The sensor module is housed in an extremely compact metal-lid LGA package with a footprint of only 2.5×2.5mm² with a height of 0.93mm. Its small dimensions and its low power consumption allow the implementation in battery driven devices such as handsets, GPS modules or watches. Datasheet <https://cdn.sparkfun.com/assets/learn_tutorials/4/1/9/BST-BME280_DS001-10.pdf> SparkFun Products SparkFun Atmospheric Sensor Breakout - BME280 <https://www.sparkfun.com/products/13676> (SEN-13676); PROD_ID: IC-13090
U2 = SparkFun-Sensors:VEML6075: Vishay VEML6075 UVA and UVB light sensor with I2C interface.; PROD_ID: IC-14149
U3 = SparkFun-Sensors:AS3935: AS3935 Franklin Lightning Sensor The AS3935 is a programmable fully integrated Lightning Sensor IC that detects the presence and approach of potentially hazardous lightning activity in the vicinity and provides an estimation on the distance to the head of the storm. The embedded lightning algorithm checks the incoming signal pattern to reject the potential man-made disturbers.The AS3935 can also provide information on the noise level and inform the external unit (e.g. microcontroller) in case of high noise conditions, with the noise floor generator and noise floor evaluation blocks.; PROD_ID: IC-11333
U5 = SparkFun-IC-Power:AP7361C-33FGE: AP7361C 3.3V LDO Regulator; PROD_ID: VREG-14094

## Net classes
0 default: width 0 mm, drill 0 mm
1 power: width 0.762 mm

## Board
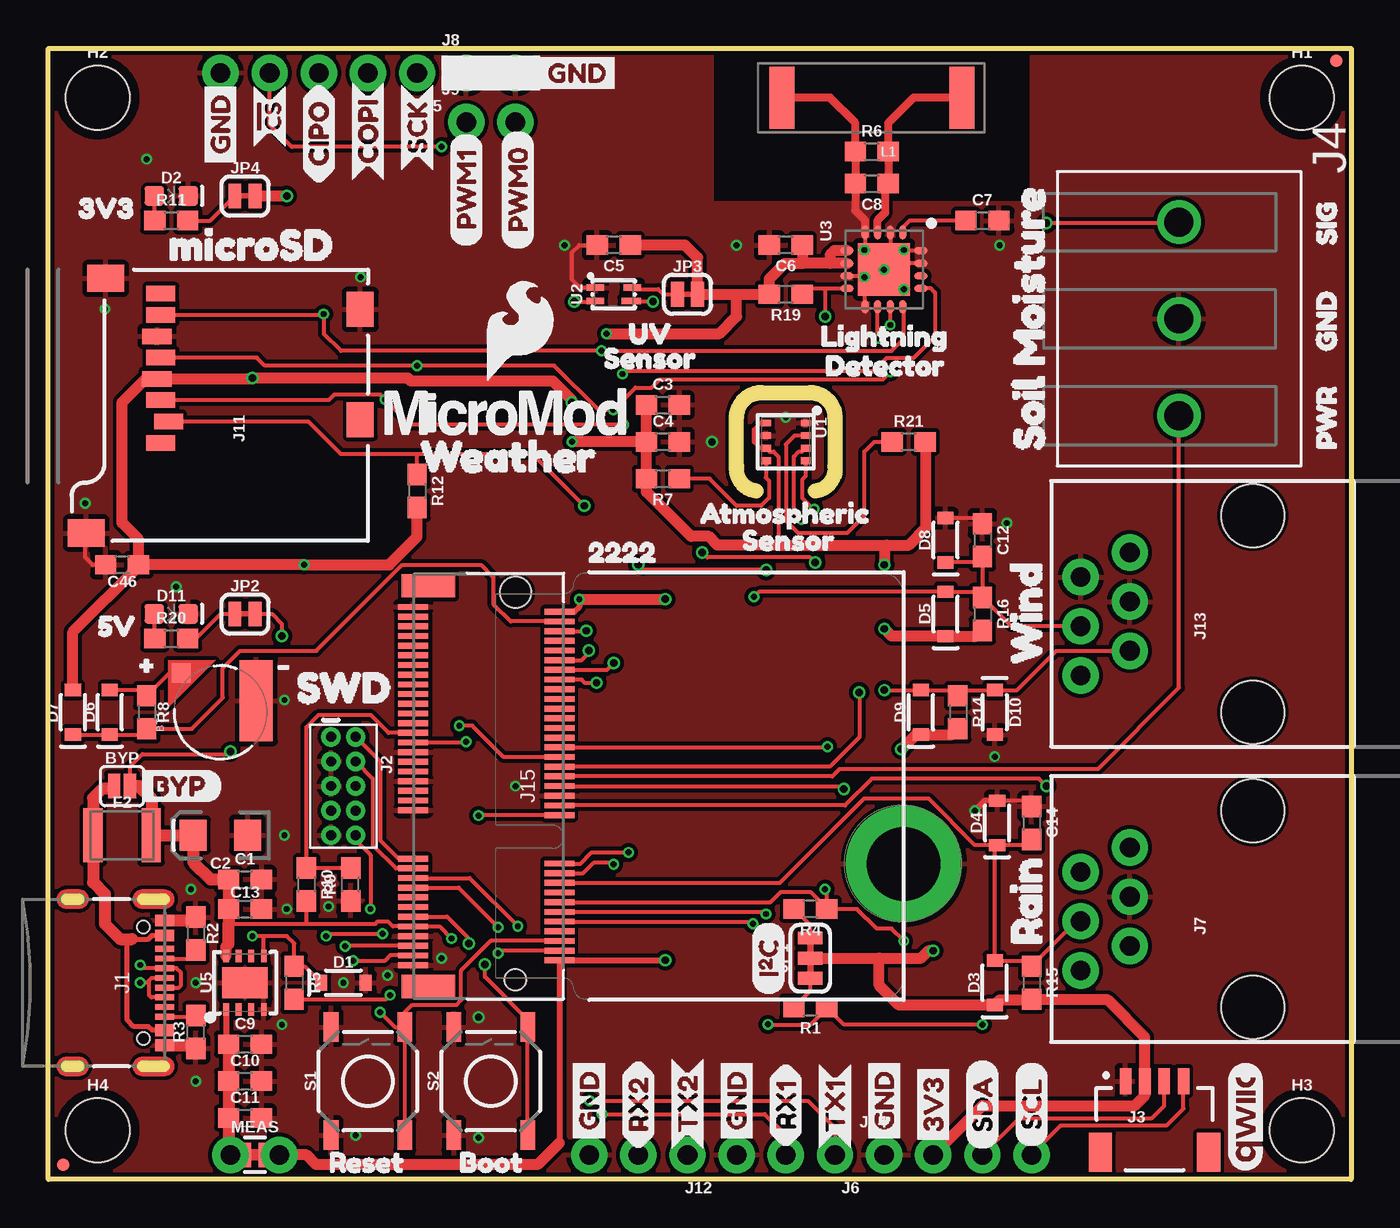
[diagram p1: board, top side]
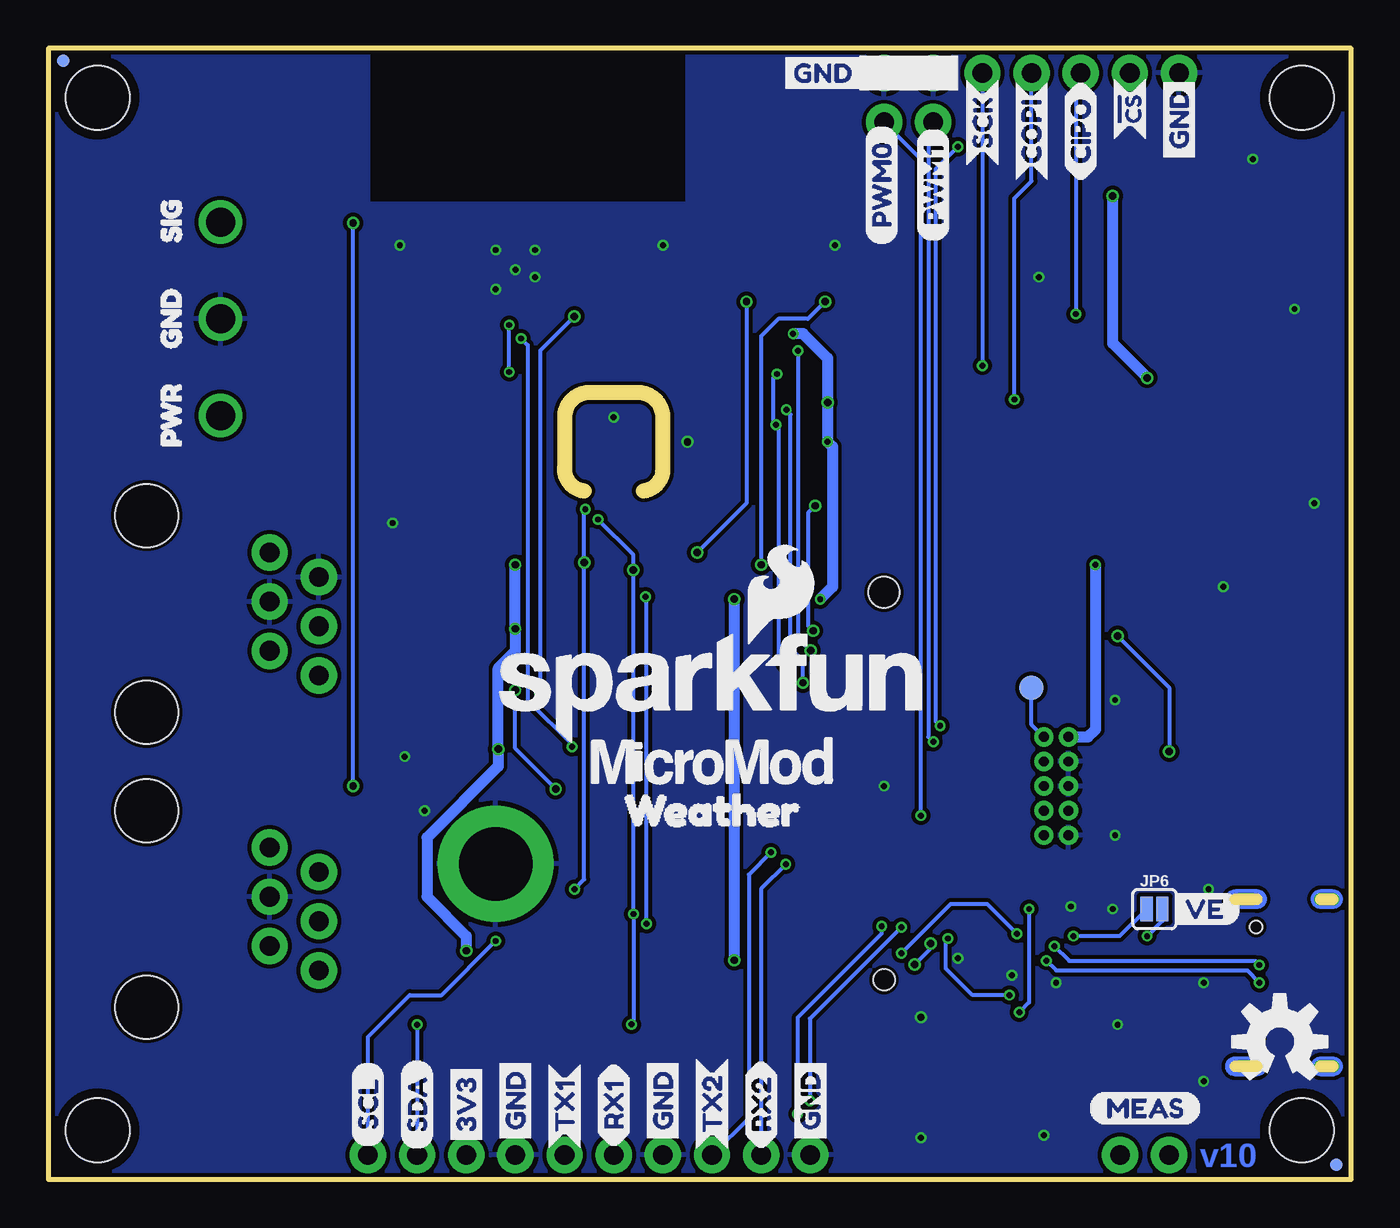
[diagram p2: board, bottom side, seen from below]

Size 67.31 x 58.42 mm. Coordinates in mm from the lower left corner, seen from the top.
Outline: 36.58,35.56 arc-90 35.56,36.83 35.56,39.37 arc-90 36.83,40.64 39.37,40.64 arc-90 40.64,39.37 40.64,36.83 arc-90 39.62,35.56
Outline: 0,0 0,58.42 67.31,58.42 67.31,0 0,0
Copper layers (1*16): Top 0.035mm / dielectric 1.5mm / Bottom 0.035mm
Design rules "SparkFun-2-layer-FAB-LIMIT": minimum track width 4mil, minimum drill 6mil, track to track 4mil, track to pad 4mil, pad to pad 4mil, via to via 4mil, smd to smd 4mil, copper to edge 4mil, drill to drill 4mil, minimum pad ring 5mil, minimum via ring 5mil, stop-mask expansion 4mil, vias tented up to drill 25mil, thermal gap 10mil
tRestrict: 4 lines

### Footprints (pad centres in the part's own frame; a part is rotated, then mirrored left to right if it is on the bottom)
ML414H_IV01E = smd 1 x 1: + 2.022,2.032 | smd 4.2 x 1.7: - 0.6,-1.85
SMT-JUMPER_2_NO_SILK = smd 0.635 x 1.27: 1 -0.406,0; 2 0.406,0
0603 = smd 1.1 x 1: 1 -0.85,0; 2 0.85,0
EIA3216 = smd 1.4 x 1.6: + 1.4,0; - -1.4,0
SOD-323 = smd 0.63 x 0.83: A 1.15,0; C -1.15,0
LED-0603 = smd 1 x 1: A -0.877,0; C 0.877,0
1210 = smd 1 x 2.8: 1 -1.5,0; 2 1.5,0
FIDUCIAL-MICRO = smd 0.635 x 0.635: 1 0,0
STAND-OFF = hole 3.302: 0,0
STAND-OFF-REFLOW-M2.5 = drill 3.8 pad 6: 1 0,0
USB-C-16P-2LAYER-PADS = smd 0.3 x 1: A5 -1.25,-0.34; A6 -0.25,-0.34; A7 0.25,-0.34; A8 1.25,-0.34; B5 1.75,-0.34; B6 0.75,-0.34; B7 -0.75,-0.34; B8 -1.75,-0.34 | smd 0.6 x 1: GND -3.225,-0.34; GND2 3.225,-0.34; VBUS1 -2.45,-0.34; VBUS2 2.45,-0.34 | drill 0.4 pad 0.6 long: SHLD1 -4.318,-0.915; SHLD2 4.318,-0.915; SHLD3 -4.318,-5.095; SHLD4 4.318,-5.095 | hole 0.65: -2.89,-1.445; 2.89,-1.445
2X5-PTH-1.27MM = drill 0.508 pad 1: 1 -2.54,-0.635; 2 -2.54,0.635; 3 -1.27,-0.635; 4 -1.27,0.635; 5 0,-0.635; 6 0,0.635; 7 1.27,-0.635; 8 1.27,0.635; 9 2.54,-0.635; 10 2.54,0.635
JST04_1MM_RA = smd 0.6 x 1.35: 1 -1.5,0; 2 -0.5,0; 3 0.5,0; 4 1.5,0 | smd 1.2 x 2: NC1 2.8,-3.675; NC2 -2.8,-3.675
LATCHTERMINAL-5MM-3 = drill 1.5: 1 -5,0; 2 0,0; 3 5,0
1X05_NO_SILK = drill 1.016 pad 1.88: 1 0,0; 2 2.54,0; 3 5.08,0; 4 7.62,0; 5 10.16,0
1X03_NO_SILK = drill 1.016 pad 1.88: 1 0,0; 2 2.54,0; 3 5.08,0
RJ11-6 = drill 1.016 pad 1.88: 1 -3.175,8.89; 2 -1.905,6.35; 3 -0.635,8.89; 4 0.635,6.35; 5 1.905,8.89; 6 3.175,6.35 | hole 3.251: -5.08,0; 5.08,0
1X02_NO_SILK = drill 1.016 pad 1.88: 1 0,0; 2 2.54,0
MICRO-SD-SOCKET = smd 1.8 x 1.4: CD1 -2.05,0.4; CD2 -7.75,0.4 | smd 0.8 x 1.5: CS/DAT3 -7.84,10.3; DAT1 -1.24,10.7; DAT2 -8.94,10.7; DI/CMD -6.74,10.7; DO/DAT0 -2.34,10.7; GND -3.44,10.9; SCLK -4.54,10.7; VCC -5.64,10.9 | smd 1.4 x 1.9: GND1 -13.6,14.55; GND3 -0.45,13.55
1X04_NO_SILK = drill 1.016 pad 1.88: 1 0,0; 2 2.54,0; 3 5.08,0; 4 7.62,0
M.2-CONNECTOR-E = smd 0.3 x 1.55: 1 9.25,-5.275; 2 9,2.275; 3 8.75,-5.275; 4 8.5,2.275; 5 8.25,-5.275; 6 8,2.275; 7 7.75,-5.275; 8 7.5,2.275; 9 7.25,-5.275; 10 7,2.275; 11 6.75,-5.275; 12 6.5,2.275; 13 6.25,-5.275; 14 6,2.275; 15 5.75,-5.275; 16 5.5,2.275; 17 5.25,-5.275; 18 5,2.275; 19 4.75,-5.275; 20 4.5,2.275; 21 4.25,-5.275; 22 4,2.275; 23 3.75,-5.275; 32 1.5,2.275; 33 1.25,-5.275; 34 1,2.275; 35 0.75,-5.275; 36 0.5,2.275; 37 0.25,-5.275; 38 0,2.275; 39 -0.25,-5.275; 40 -0.5,2.275; 41 -0.75,-5.275; 42 -1,2.275; 43 -1.25,-5.275; 44 -1.5,2.275; 45 -1.75,-5.275; 46 -2,2.275; 47 -2.25,-5.275; 48 -2.5,2.275; 49 -2.75,-5.275; 50 -3,2.275; 51 -3.25,-5.275; 52 -3.5,2.275; 53 -3.75,-5.275; 54 -4,2.275; 55 -4.25,-5.275; 56 -4.5,2.275; 57 -4.75,-5.275; 58 -5,2.275; 59 -5.25,-5.275; 60 -5.5,2.275; 61 -5.75,-5.275; 62 -6,2.275; 63 -6.25,-5.275; 64 -6.5,2.275; 65 -6.75,-5.275; 66 -7,2.275; 67 -7.25,-5.275; 68 -7.5,2.275; 69 -7.75,-5.275; 70 -8,2.275; 71 -8.25,-5.275; 72 -8.5,2.275; 73 -8.75,-5.275; 74 -9,2.275; 75 -9.25,-5.275 | smd 1.2 x 2.75: A1 10.35,-4.5; A2 -10.35,-4.5 | hole 1.1: 10,0 | hole 1.6: -10,0
SMT-JUMPER_3_2-NC_TRACE_SILK = smd 0.66 x 1.27: 1 -1.041,0; 2 0,0; 3 1.041,0
SMT-JUMPER_2_NC_TRACE_SILK = smd 0.66 x 1.27: 1 -0.521,0; 2 0.521,0
MA5532-AE = smd 1.3 x 3.2: 1 -4.65,0; 2 4.65,0
COMBO-JUMPER_2_NC_TRACE = smd 0.635 x 1.27: 1 -0.508,0; 2 0.508,0 | drill 1.016 pad 1.88: 3 -1.27,0; 4 1.27,0
TACTILE_SWITCH_SMD_5.2MM = smd 1.524 x 0.762: 1 -2.794,1.905; 2 2.794,1.905; 3 -2.794,-1.905; 4 2.794,-1.905
PAD.03X.05 = smd 1.27 x 1.27: P$1 0,0
LGA-8-2.5X2.5 = smd 0.35 x 0.5: 1 -0.975,1.025; 2 -0.325,1.025; 3 0.325,1.025; 4 0.975,1.025; 5 0.975,-1.025; 6 0.325,-1.025; 7 -0.325,-1.025; 8 -0.975,-1.025
VEML6075_A3OP = smd 0.9 x 0.35: 1 -0.95,0.35; 2 -0.95,-0.35; 4 0.95,0.35 | smd 1 x 0.35: 3 0.9,-0.35
16LD_MLPQ = smd 0.7 x 0.35: 1 -1.919,0.968; 2 -1.919,0.318; 3 -1.919,-0.332; 4 -1.919,-0.982; 9 1.908,-0.982; 10 1.908,-0.332; 11 1.908,0.318; 12 1.908,0.968 | smd 0.35 x 0.7: 5 -0.982,-1.917; 6 -0.332,-1.917; 7 0.318,-1.917; 8 0.968,-1.917; 13 0.968,1.907; 14 0.318,1.907; 15 -0.332,1.907; 16 -0.982,1.907 | smd 2.7 x 2.7: 17 -0.007,-0.007
UDFN-8 = smd 0.3 x 0.65: 1 -0.975,-1.375; 2 -0.325,-1.375; 3 0.325,-1.375; 4 0.975,-1.375; 5 0.975,1.375; 6 0.325,1.375; 7 -0.325,1.375; 8 -0.975,1.375 | smd 2.35 x 1.6: EP 0,0

### Placement (x,y rotation side)
BT1  8.89,24.13 90 top
BYP  3.81,20.32 0 top
C1  10.16,15.49 0 top
C2  8.89,17.78 180 top
C3  31.75,40.01 0 top
C4  31.75,38.1 0 top
C5  29.21,48.26 180 top
C6  38.1,48.26 180 top
C7  48.26,49.53 0 top
C8  42.55,51.44 180 top
C9  10.16,6.99 0 top
C10  10.16,5.08 0 top
C11  10.16,3.17 0 top
C12  48.26,33.02 270 top
C13  10.16,13.97 0 top
C14  50.8,18.41 270 top
C46  3.81,31.75 180 top
D1  15.24,10.16 0 top
D2  6.35,50.8 0 top
D3  48.9,10.16 90 top
D4  49.02,18.41 90 top
D5  46.35,29.21 90 top
D6  3.17,24.13 90 top
D7  1.27,24.13 90 top
D8  46.35,33.02 90 top
D9  45.09,24.13 90 top
D10  48.9,24.13 270 top
D11  6.35,29.21 0 top
F2  3.81,17.78 0 top
FD1  0.76,0.76 0 top
FD2  66.55,57.78 0 top
FD3  0.76,0.76 0 bottom
FD4  66.55,57.78 0 bottom
FRAME1  8.89,-21.59 0 top  (outside the outline)
H1  64.77,55.88 0 top
H2  2.54,55.88 0 top
H3  64.77,2.54 0 top
H4  2.54,2.54 0 top
H5  44.2,16.3 0 top
J1  6.35,10.16 270 top
J2  15.24,20.32 270 top
J3  57.15,5.08 0 top
J4  58.42,44.45 270 top
J5  19.05,57.15 180 top
J6  40.64,1.27 180 top
J7  62.23,13.97 90 top
J8  21.59,57.15 0 top
J9  21.59,54.61 0 top
J11  16.51,46.99 90 top
J12  33.02,1.27 180 top
J13  62.23,29.21 90 top
J14  43.18,1.27 0 top
J15  24.13,20.32 270 top
JP1  39.37,11.43 90 top
JP2  10.16,29.21 0 top
JP3  33.02,45.72 0 top
JP4  10.16,50.8 0 top
JP6  10.16,13.97 0 bottom
L1  42.55,55.88 180 top
LOGO1  33.02,25.4 0 bottom
LOGO2  61.85,3.24 90 top
LOGO3  3.68,7.11 0 bottom
MEAS  10.67,1.27 0 top
R1  39.37,8.89 180 top
R2  7.62,12.7 270 top
R3  7.62,7.62 90 top
R4  39.37,13.97 180 top
R5  12.7,10.16 270 top
R6  42.55,53.09 0 top
R7  31.75,36.2 180 top
R8  5.08,24.13 270 top
R9  15.62,15.24 90 top
R10  13.34,15.24 270 top
R11  6.35,49.53 0 top
R12  19.05,35.56 270 top
R14  46.99,24.13 270 top
R15  50.8,10.16 270 top
R16  48.26,29.21 270 top
R19  38.1,45.72 180 top
R20  6.35,27.94 0 top
R21  44.45,38.1 0 top
S1  16.51,5.08 90 top
S2  22.86,5.08 90 top
TP1  16.51,25.4 0 bottom
U1  38.1,38.1 270 top
U2  29.21,45.72 0 top
U3  43.18,46.99 270 top
U5  10.16,10.16 0 top
U$1  [3V31]  0.64,50.16 0 top
U$2  [RESET3]  13.59,0.89 0 top
U$3  [RAIN1]  50.55,10.79 90 top
U$4  [GND0]  66.04,41.91 90 top
U$5  [MEAS]  13.59,3.68 0 bottom
U$6  [GND_P]  8.89,52.07 90 top
U$7  [COPI0]  16.51,51.56 90 top
U$8  [COPI0]  16.51,51.56 90 bottom
U$9  [SCK_O]  19.05,52.07 90 top
U$10  [!CS_O]  11.43,53.09 90 top
U$11  [GND_P]  29.72,57.15 0 bottom
U$12  [PWR2]  66.04,36.83 90 top
U$13  [SIG1]  66.04,47.37 90 top
U$14  [BYP0]  4.45,20.32 0 top
U$15  [PWM10]  21.59,48.39 90 bottom
U$16  [WEATHER4]  17.91,37.34 0 top
U$17  [RX25]  30.48,1.52 90 top
U$18  [5V0]  1.65,28.57 0 top
U$19  [BOOT2]  20.32,0.89 0 top
U$20  [ATMOSPHERIC0]  32.77,34.42 0 top
U$21  [VE0]  9.53,13.97 0 bottom
U$22  [LIGHTNING8]  38.99,43.56 0 top
U$23  [GND_P]  27.94,1.65 90 bottom
U$24  [PWR2]  60.96,36.96 90 bottom
U$25  [RX10]  38.1,1.65 90 bottom
U$27  [CIPO0]  13.97,51.44 90 top
U$28  [TX24]  33.02,1.52 90 bottom
U$29  [RX10]  38.1,1.65 90 top
U$30  [RX25]  30.48,1.52 90 bottom
U$31  [TX13]  40.64,1.52 90 top
U$32  [GND_P]  35.56,1.65 90 top
U$33  [GND_P]  27.94,1.65 90 top
U$34  [SENSOR7]  27.69,42.42 0 top
U$35  [MICROSD0]  4.83,48.26 0 top
U$36  [GND_P]  43.18,1.65 90 top
U$37  [I2C]  37.21,9.53 90 top
U$38  [3V3_P]  45.72,1.52 90 top
U$39  [SDA_IO]  48.26,1.52 90 top
U$40  [SCL_IO]  50.8,1.65 90 top
U$41  [TX13]  40.64,1.52 90 bottom
U$42  [GND_P]  35.56,1.65 90 bottom
U$43  [SWD1]  11.43,25.4 0 top
U$44  [SFE_LOGO_FLAME_.2]  24.38,43.81 0 top
U$45  [GND_P]  43.18,1.65 90 bottom
U$46  [3V3_P]  45.72,1.52 90 bottom
U$47  [SDA_IO]  48.26,1.52 90 bottom
U$48  [SCL_IO]  50.8,1.65 90 bottom
U$49  [SCK_O]  19.05,52.32 90 bottom
U$50  [CIPO0]  13.97,51.56 90 bottom
U$52  [!CS_O]  11.43,53.47 90 bottom
U$53  [GND_P]  8.89,52.32 90 bottom
U$54  [GND_P]  24.89,57.15 0 top
U$55  [22229]  26.96,32.39 0 top
U$56  [TX24]  33.02,1.52 90 top
U$57  [GND0]  60.96,42.04 90 bottom
U$58  [WEATHER4]  38.86,19.05 0 bottom
U$59  [PWM01]  24.26,48.26 90 bottom
U$60  [PWM01]  24.26,48.01 90 top
U$61  [PWM10]  21.59,48.13 90 top
U$62  [UV6]  29.08,43.69 0 top
U$63  [SIG1]  60.96,47.5 90 bottom
U$64  [SENSOR1]  34.92,33.02 0 top
U$65  [SOIL_MOISTURE2]  50.67,36.32 90 top
U$66  [WIND0]  50.55,25.27 90 top
U$67  [MICROMOD_LOGO_.5]  23.62,39.62 0 top
U$68  [MICROMOD_LOGO_.5]  33.02,21.59 0 bottom
U$69  [#0]  3.81,26.67 0 top
U$70  [#1]  10.92,26.67 0 top
U$71  [DETECTOR2]  39.24,42.04 0 top

### Tracks (layer width: path | path; a pad name or v marks a point on that pad's centre or on a via)
3.3V  (via drill 0.3, 0.38)
  Top 0.203: C46.1 4.7,31.71 4.74,31.75 | 46.69,22.98 R14.2 | 47.96,28.06 R16.2 | U1.8 36.79,39.08 36.45,38.73 36.45,38.1 36.77,37.77 U1.6 37.26,37.59 37.47,37.59 37.72,37.34 37.72,32.77 | v27.05,38.1 27.06,38.11 | 30.89,38.11 C4.1 | 45.34,38.06 R21.2 | D9.C 44.82,22.98 | 38.95,47.36 38.99,47.32
  Top 0.305: 26.41,1.89 J15.2 v31.88,11.32 | J15.74 27.16,29.32 27.43,29.59 v27.43,29.97
  Top 0.559: D7.A 1.27,28.28 4.7,31.71 | 4.74,31.75 v13.21,31.75 17.61,31.75 19.05,33.19 R12.2 | U3.6 40.39,47.32 | 40.39,47.32 38.99,47.32 38.05,47.32 37.25,46.52 R19.2 35.56,45.72 | U3.5 40.61,47.97 40.39,47.75 40.39,47.32 | J14.2 48.26,3.81 56.13,3.81 56.65,4.33 J3.2 56.65,7.36 54.74,9.27 50.84,9.27 | 26.41,1.89 25.27,0.76 13.84,0.76 13.34,1.27 11.56,1.27 | JP1.2 42.93,11.43 | 42.93,11.43 45.09,11.43 45.47,11.81 v45.72,11.81 | D9.C 46.69,22.98 | 47.96,28.06 D5.C 43.58,28.06 v43.19,28.45 | C3.1 C4.1 R7.2 30.9,35.52 33.21,33.21 34.12,33.21 34.57,32.77 37.72,32.77 43.31,32.77 | 30.89,38.11 27.06,38.11 | 45.34,38.06 45.34,33.66 44.45,32.77 43.31,32.77 | 44.82,22.98 v44.07,22.23 | C6.1 38.95,47.36 | v27.05,40.13 27.05,40.26 26.06,41.25 18.72,41.25 18.57,41.4 v10.54,41.4 10.49,41.35 J11.VCC 5.03,41.35 3.81,40.13 3.81,33.91 4.66,33.06 C46.1 | 35.56,45.72 JP3.2 33.54,47.61 32.89,48.26 C5.1 | v28.83,43.69 34.67,43.69 35.56,44.58 35.56,45.72 | 50.84,9.27 R15.2 | 42.93,11.43 42.93,10.03 43.95,9.01 D3.C 49.16,9.27 50.84,9.27 | 43.31,32.77 43.19,32.65 v43.19,31.75 | v27.43,29.97 v31.88,29.97 | JP4.2 v12.32,50.8
  Top 0.61: MEAS.2 11.56,1.27 MEAS.4
  Bottom 0.559: J2.1 13.59,22.86 13.21,23.24 v13.21,31.75 | v27.43,29.97 26.8,30.61 26.8,37.85 v27.05,38.1 v27.05,40.13 27.05,42.42 28.32,43.69 v28.83,43.69 | v45.72,11.81 45.72,12.57 47.75,14.61 47.75,17.65 44.07,21.34 v44.07,22.23 44.07,26.42 43.18,27.3 43.18,28.43 v43.19,28.45 v43.19,31.75 | v31.88,29.97 v31.88,11.32 | v12.32,50.8 12.32,43.18 v10.54,41.4
3.3V_EN  (via drill 0.3)
  Top 0.203: v23.24,11.68 23.38,11.82 J15.4 | v17.27,12.7 14.48,12.7 v14.35,12.57
  Bottom 0.203: v17.27,12.7 18.8,14.22 20.7,14.22 v23.24,11.68 | JP6.1 11.96,12.57 v14.35,12.57
!BOOT!  (via drill 0.38)
  Top 0.203: v22.56,11.1 22.56,10.46 24.77,8.26 S2.4 S2.3 | v21.73,12.19 21.73,12.43 20.59,13.57 J15.11
  Bottom 0.203: v21.73,12.19 21.73,11.93 v22.56,11.1
!RESET!  (via drill 0.3)
  Top 0.203: J2.10 15.88,17.53 16.64,16.76 v16.64,13.97 | v17.14,8.64 17.91,7.87 S1.4 | S1.4 18.41,8.64 18.8,9.02 21.08,9.02 21.34,9.27 21.34,10.79 22.86,12.32 J15.6 | S1.4 S1.3
  Bottom 0.203: v16.64,13.97 16.64,9.14 v17.14,8.64
GND  (via drill 0.3, 0.38)
  Top 0.203: C46.2 2.29,31.75 1.91,32.13 1.91,33.34 J11.GND1 | U3.4 42.2,48.17 | U3.2 43.5,48.2 | U3.16 44.36,47.97 | U3.15 44.37,47.32 | C14.1 50.5,19.57 D4.A | D8.A 47.96,34.17 C12.1 | U3.9 42.2,46.58 v42.16,46.61 42.1,46.67 U3.7 | U2.1 27.46,46.07 27.05,46.48 27.05,47.88 27.43,48.26 C5.2
  Top 0.305: D4.A 48.39,19.57 v47.88,19.05
  Top 0.406: L1.2 40.39,55.88 41.7,54.57 R6.1 C8.2 41.7,50.05 42.2,49.54 U3.4
  Top 0.61: J1.GND2 7.46,6.93 R3.1 | J1.GND 7.46,13.38 R2.1
  other vias: 38.1,39.37 42.16,48.01 43.18,46.99 44.2,48.01 44.2,45.97 12.32,13.97 15.24,10.16 24.13,20.32 20.32,11.43 17.53,10.54 7.62,5.08 7.37,14.99 14.48,14.1 22.23,8.38 34.29,38.1 12.19,17.78 12.06,8 15.88,2.29 22.23,2.16 7.62,10.16 6.6,30.61 12.19,24.77 1.91,34.92 2.92,44.96 5.08,52.7 16.13,46.61 26.67,48.26 35.56,48.26 49.15,48.26 49.53,33.91 48.9,21.84
  pour Top (isolate 0.203): 0,58.42 0,0 67.31,0 67.31,58.42 50.8,58.42 50.8,50.42 34.29,50.42 34.29,58.42
  pour Bottom (isolate 0.203): 0,58.42 0,0 67.31,0 67.31,58.42 50.8,58.42 50.8,50.42 34.29,50.42 34.29,58.42
HEADER_!CS!  (via drill 0.3)
  Top 0.203: J15.44 23.52,21.82 21.9,23.44 v21.23,23.44 | v20.32,53.34 12.57,53.34 11.43,54.48 J5.4
  Bottom 0.203: v21.23,23.44 21.46,23.66 21.46,52.2 v20.32,53.34
I2C_SCL  (via drill 0.3, 0.38)
  Top 0.203: J14.4 52.32,2.79 57.78,2.79 58.65,3.66 J3.4 | v44.2,12.32 43.56,12.95 42.8,12.95 41.78,13.97 R4.1 | R4.1 40.22,14.01 39.37,14.86 37.85,14.86 37.31,14.32 J15.14 | U1.4 39.12,36.33 38.96,36.17 38.96,35.18 39.53,34.62 v39.57,34.62 | R4.1 40.22,14.9 v40.13,14.99 | v31.24,45.34 31.21,45.37 U2.3 | v39.62,31.86 39.36,32.13 34.04,32.13 v33.78,32.38
  Bottom 0.203: J14.4 50.8,7.37 48.64,9.53 46.99,9.53 v44.2,12.32 | v40.13,14.99 39.62,15.49 v39.62,31.86 39.62,34.56 v39.57,34.62 | v31.24,45.34 31.24,34.92 v33.78,32.38
I2C_SDA  (via drill 0.3, 0.38)
  Top 0.203: J14.3 50.16,3.17 57.02,3.17 57.65,3.8 J3.3 | v48.26,8 41.11,8 R1.1 40.22,8.85 39.37,8 v37.18,8 v37.18,8.01 | v37.08,13.71 36.97,13.82 J15.12 | U1.3 38.93,37.58 38.76,37.58 38.52,37.34 38.52,34.48 v38.91,34.09 | v30.48,31.75 30.75,31.48 v37.08,31.48 | U2.2 28.23,45.34 v27.18,45.34
  Bottom 0.203: v48.26,8 J14.3 | v37.18,8.01 37.08,8.1 v37.08,13.71 v37.08,31.48 37.08,32.26 v38.91,34.09 | v27.18,45.34 28.07,44.45 29.59,44.45 30.48,43.56 v30.48,31.75
INP
  Top 0.203: 43.23,51.27 C8.1
  Top 0.406: 43.23,51.27 43.23,49.92 42.85,49.54 U3.3 | C8.1 R6.2 43.4,54.57 44.7,55.88 L1.1
LIGHTNING_!CS!  (via drill 0.38)
  Top 0.203: R19.1 39.25,46.02 40.13,46.02 | 40.13,46.02 U3.8 | 40.13,46.02 v40.13,44.58 | v41.9,25.16 41.9,22.85 40.37,21.32 J15.42
  Bottom 0.203: v40.13,44.58 41.9,42.81 v41.9,25.16
LIGHTNING_INT  (via drill 0.3)
  Top 0.203: J15.46 40.23,22.32 v40.26,22.35 | v42.89,43.43 42.85,43.47 U3.10
  Bottom 0.203: v40.26,22.35 40.26,22.48 42.55,24.77 42.55,43.09 v42.89,43.43
N$1
  Top 0.305: U5.1 9.19,7.11
  Top 0.61: 9.19,7.11 C9.1 C10.1 C11.1 9.31,1.36 MEAS.3 MEAS.1
N$2
  Top 0.203: JP1.3 39.37,13.12 R4.2
N$3
  Top 0.203: R1.2 39.37,9.74 JP1.1
N$4
  Top 0.203: JP4.1 8.37,49.53 R11.2
N$5
  Top 0.203: R20.2 7.62,27.94 8.89,29.21 JP2.1
N$6
  Top 0.203: D2.A 5.47,49.56 R11.1
N$7
  Top 0.203: JP3.1 31.78,45.72 31.51,45.99 30.24,45.99 U2.4
N$8
  Top 0.203: U1.5 37.08,36.25 37.24,36.09 37.24,35.2 36.83,34.8 35.56,34.8 34.16,36.2 R7.1
N$10
  Top 0.203: J1.A5 7.18,11.41 R2.2
N$11
  Top 0.203: J1.B5 7.56,8.41 R3.2
N$14
  Top 0.203: BT1.+ 6.25,26.15 R8.1 4.78,25.28 D6.A
N$15
  Top 0.203: C7.1 44.49,49.53 44.15,49.19 U3.1
N$16
  Top 0.203: D11.A 5.47,27.97 R20.1
N$19
  Top 0.203: U1.2 38.55,38.42 38.1,37.97 38.1,34.04 38.73,33.4 41.27,33.4 42.16,34.29 42.16,37.59 42.67,38.1 R21.1
PWM0  (via drill 0.3)
  Top 0.203: J15.32 22.25,18.82 v22.23,18.8
  Bottom 0.203: v22.23,18.8 22.23,52.7 J9.2
PWM1  (via drill 0.3)
  Top 0.203: J15.47 21.55,22.57 v21.59,22.61
  Bottom 0.203: v21.59,22.61 21.84,22.86 21.84,54.36 J9.1
RAIN
  Top 0.203: J7.3 53.12,13.34 R15.1 50.5,11.31 D3.A 48.9,17.14 D4.C | C14.2 50.5,17.27 D4.C | J15.18 37.8,15.32 42.16,19.68 45.46,19.68 47.88,17.27 D4.C
RTC_3V
  Top 0.203: D7.C D6.C 4.78,22.98 R8.2 7.41,23.28 9.02,24.89 9.02,26.42 9.91,27.3 13.84,27.3 18.29,31.75 22.35,31.75 22.99,31.11 22.99,29.72 23.89,28.82 J15.72
RX1  (via drill 0.3)
  Top 0.203: v24.26,13.08 21.77,15.57 J15.19 | v28.6,3.38 37.01,3.38 38.1,2.29 J6.2
  Bottom 0.203: v24.26,13.08 24.26,12.7 28.6,8.36 v28.6,3.38
RX2  (via drill 0.3)
  Top 0.203: v29.21,16.28 29.11,16.38 28.19,16.38 27.63,15.82 J15.20
  Bottom 0.203: v29.21,16.28 30.48,15.01 J12.2
SD_!CS!  (via drill 0.38)
  Top 0.203: J11.CS/DAT3 13.43,39.15 15.11,37.47 19.05,37.47 | v27.69,34.8 25.02,37.47 19.05,37.47 | J15.70 27.78,28.32 v27.8,28.34 | R12.1 19.05,37.47
  Bottom 0.203: v27.8,28.34 28.05,28.59 28.05,34.43 v27.69,34.8 | v27.69,34.8
SOIL_MOIST_PWR
  Top 0.203: J15.40 40.5,20.82 40.88,21.2 54.22,21.2 58.42,25.4 J4.3
SOIL_MOIST_SIG  (via drill 0.38)
  Top 0.203: v51.56,20.32 51.18,20.7 42.55,20.7 41.16,19.32 J15.34 | v51.56,49.4 58.37,49.4 J4.1
  Bottom 0.203: v51.56,20.32 v51.56,49.4
SPI_CIPO  (via drill 0.3, 0.38)
  Top 0.203: J11.DO/DAT0 14.17,44.65 v14.22,44.7 14.22,43.69 15.11,42.8 v28.57,42.8 43.56,42.8 44.2,43.43 44.2,45.03 U3.12 | J15.64 27.54,26.82 27.93,27.21 v27.93,27.32
  Bottom 0.203: J5.3 14.22,56.9 v14.22,44.7 | v27.93,27.32 28.57,27.97 v28.57,42.8
SPI_COPI  (via drill 0.3, 0.38)
  Top 0.203: U3.13 45.59,46.02 45.81,45.81 45.81,43.52 44.7,42.42 43.31,42.42 42.62,41.73 29.79,41.73 v29.67,41.6 | J11.DI/CMD 14.48,40.25 14.77,40.54 17.14,40.54 v17.4,40.28 18.69,38.99 v29.72,38.99 | v29.21,26.67 28.86,26.32 J15.62
  Bottom 0.203: v29.21,26.67 29.59,27.05 29.59,38.86 v29.72,38.99 29.84,39.12 29.84,41.43 v29.67,41.6 | J5.2 16.51,51.56 17.4,50.67 v17.4,40.28
SPI_SCK  (via drill 0.3, 0.38)
  Top 0.203: v28.32,25.65 27.71,25.65 27.55,25.82 J15.60 | v43.5,44.13 U3.11 | J11.SCLK 10.76,42.45 11.18,42.04 v19.05,42.04 26.14,42.04 28.42,39.75 v29.18,39.75 30.33,40.89 31.17,40.89 31.6,41.33 43.12,41.33 v43.5,41.71
  Bottom 0.203: J5.1 v19.05,42.04 | v28.32,25.65 28.32,26.8 28.96,27.43 28.96,39.52 v29.18,39.75 | v43.5,41.71 v43.5,44.13
SWDCK
  Top 0.203: J2.4 16.76,20.7 16.76,17.27 17.97,16.07 J15.21
SWDIO
  Top 0.203: J2.2 17.14,21.59 17.14,17.53 18.1,16.57 J15.23
  Bottom 0.203: J2.2 16.51,23.5 TP1.P$1
TX1  (via drill 0.3)
  Top 0.203: v23.24,13.03 21.2,15.07 J15.17 | v27.96,4.06 39.24,4.06 40.64,2.67 J6.1
  Bottom 0.203: v23.24,13.03 27.96,8.31 v27.96,4.06
TX2  (via drill 0.3)
  Top 0.203: v29.97,16.89 28.07,16.89 27.5,16.32 J15.22
  Bottom 0.203: v29.97,16.89 31.11,15.75 31.11,3.17 J12.1
USB_D+  (via drill 0.3)
  Top 0.203: J1.B6 5.32,9.41 5.21,9.53 5.21,10.16 | J1.A6 5.33,10.41 5.21,10.29 5.21,10.16 | 5.21,10.16 v4.74,10.16 | v15.75,11.3 17.4,11.3 17.67,11.57 J15.3
  Bottom 0.203: v4.74,10.16 5.37,10.79 15.24,10.79 v15.75,11.3
USB_D-  (via drill 0.3)
  Top 0.203: J1.A7 6.74,9.91 6.86,10.03 6.86,10.67 6.62,10.91 J1.B7 4.9,10.91 v4.74,11.08 | v15.33,12.05 15.35,12.07 J15.5
  Bottom 0.203: v4.74,11.08 4.95,11.29 14.57,11.29 v15.33,12.05
V_USB
  Top 0.254: J1.VBUS1 5.36,12.61 5.17,12.42 4.32,12.42 4.09,12.42 4.06,12.39 4.06,8.26 4.42,7.9 5.17,7.9 5.36,7.71 J1.VBUS2
  Top 0.61: BYP.1 3.28,20.19 2.79,20.19 2.31,19.71 F2.1 2.31,15.34 2.92,14.73 2.92,13.21 3.71,12.42 4.32,12.42
VIN  (via drill 0.3, 0.38)
  Top 0.203: R5.2 17.44,9.31 v17.65,9.53 | v20.83,12.45 20.2,13.07 J15.9 17.79,13.07 17.53,13.34 17.02,13.34 16.87,13.19 13.34,13.19 | 13.34,13.19 R10.2 | BYP.2 4.22,21.34 4.85,21.97 9.27,21.97 v9.4,22.1 | 13.34,13.19 9.33,13.19 9.31,13.21 | JP2.2 11.56,29.21 12.06,28.7 v12.06,28.07
  Top 0.559: U5.8 9.19,12.04 9.31,12.17
  Top 0.61: BYP.2 4.7,20.32 5.33,19.68 5.33,17.8 F2.2 C2.+ 7.49,16.39 8.38,15.49 C1.1 C13.1 9.31,13.21 9.31,12.17
  Bottom 0.203: v17.65,9.53 19.56,9.53 20.95,10.92 20.95,12.32 v20.83,12.45 | v12.06,28.07 9.4,25.4 v9.4,22.1
VIN/3
  Top 0.203: J15.49 17.57,23.07 16.64,24 13.97,24 13.34,23.37 R10.1 R9.2
VREG_EN  (via drill 0.3)
  Top 0.203: D1.C 13.24,11.01 R5.1 12.7,12.19 12.32,12.57 11.05,12.57 | 11.05,12.57 v10.54,12.57 | U5.5 11.13,12.49 11.05,12.57
  Bottom 0.203: v10.54,12.57 9.75,13.36 JP6.2
WDIR  (via drill 0.38)
  Top 0.203: J13.2 52.07,27.3 50.05,25.28 D10.C 47.29,25.28 R14.1 46.69,25.28 D9.A v43.2,25.28 v43.19,25.27 | J15.38 40.95,20.32 v41.1,20.17
  Bottom 0.203: v41.1,20.17 43.19,22.27 v43.19,25.27
WSPEED  (via drill 0.3)
  Top 0.203: J13.3 49.74,28.57 R16.1 | R16.1 C12.2 47.96,31.87 D8.C | R16.1 47.96,30.36 D5.A 36.7,30.35 v36.45,30.1 | J15.10 36.29,13.32 v36.4,13.21
  Bottom 0.203: v36.4,13.21 36.4,30.05 v36.45,30.1

### Text on the board
Bottom: v10
Dimension: ROUTE OUT | ROUTE OUT | ROUTE OUT
Measures: in | in | in | in
Document: Selective Solder Nozzle Width: / 0.354331
tDocu: Priyanka Makin